# Altium schematic sheet 4Switch_DCDC.SchDoc
size OrCAD A; SheetNumber: 1; SheetTotal: 4
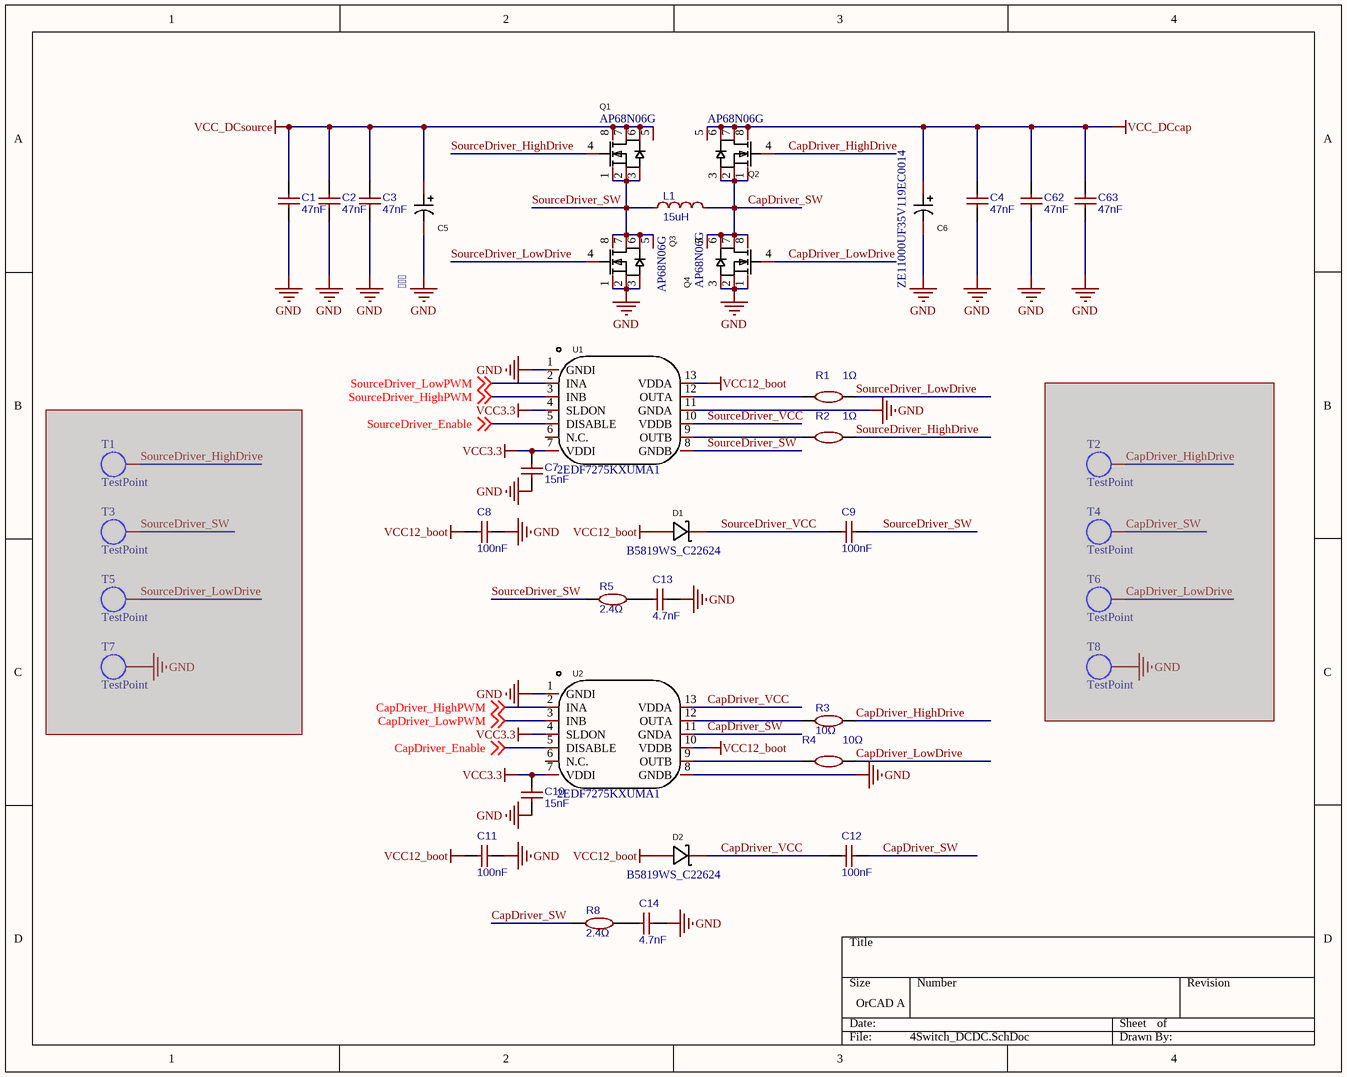
[diagram p0: 4Switch_DCDC.SchDoc]

## Parts
C1  47nF  [C-RAD-0805]
C2  47nF  [C-RAD-0805]
C3  47nF  [C-RAD-0805]
C4  47nF  [C-RAD-0805]
C5    [CAP-TH_BD10.0-P5.00-D0.6-FD-A]
C6  ZE11000UF35V119EC0014  [CAP-TH_BD10.0-P5.00-D0.6-FD-A]
C7  15nF  [C-RAD-0603]
C8  100nF  [C-RAD-0603]
C9  100nF  [C-RAD-0603]
C10  15nF  [C-RAD-0603]
C11  100nF  [C-RAD-0603]
C12  100nF  [C-RAD-0603]
C13  4.7nF  [C-RAD-0805]
C14  4.7nF  [C-RAD-0805]
C62  47nF  [C-RAD-0805]
C63  47nF  [C-RAD-0805]
D1  B5819WS_C22624  [SOD-323_L1.8-W1.3-LS2.5-BI]
D2  B5819WS_C22624  [SOD-323_L1.8-W1.3-LS2.5-BI]
L1  15uH  [L-SMD-22]
Q1  AP68N06G  [VDFN8]
Q2  AP68N06G  [VDFN8]
Q3  AP68N06G  [VDFN8]
Q4  AP68N06G  [VDFN8]
R1  1Ω  [0603-1]
R2  1Ω  [0603-1]
R3  10Ω  [0603-1]
R4  10Ω  [0603-1]
R5  2.4Ω  [0805-1]
R8  2.4Ω  [0805-1]
T1  TestPoint  [TestPoint]  (masked out: inside a compile mask, not in the netlist)
T2  TestPoint  [TestPoint]  (masked out: inside a compile mask, not in the netlist)
T3  TestPoint  [TestPoint]  (masked out: inside a compile mask, not in the netlist)
T4  TestPoint  [TestPoint]  (masked out: inside a compile mask, not in the netlist)
T5  TestPoint  [TestPoint]  (masked out: inside a compile mask, not in the netlist)
T6  TestPoint  [TestPoint]  (masked out: inside a compile mask, not in the netlist)
T7  TestPoint  [TestPoint]  (masked out: inside a compile mask, not in the netlist)
T8  TestPoint  [TestPoint]  (masked out: inside a compile mask, not in the netlist)
U1  2EDF7275KXUMA1  [LGA-13]
U2  2EDF7275KXUMA1  [LGA-13]

## Nets
GND: C1.1 C2.1 C3.1 C4.1 C5.2 C6.2 C7.1 C8.2 C10.1 C11.2 C13.2 C14.2 C62.1 C63.1 Q3.1(S) Q3.2(S) Q3.3(S) Q4.1(S) Q4.2(S) Q4.3(S) U1.1(GNDI) U1.11(GNDA) U2.1(GNDI) U2.8(GNDB)
VCC3.3: C7.2 C10.2 U1.4(SLDON) U1.7(VDDI) U2.4(SLDON) U2.7(VDDI)
VCC12_boot: C8.1 C11.1 D1.2(A) D2.2(A) U1.13(VDDA) U2.10(VDDB)
VCC_DCcap: C4.2 C6.1 C62.2 C63.2 Q2.5(D) Q2.6(D) Q2.7(D) Q2.8(D)
VCC_DCsource: C1.2 C2.2 C3.2 C5.1 Q1.5(D) Q1.6(D) Q1.7(D) Q1.8(D)
CapDriver_Enable: U2.5(DISABLE) ; off-sheet CapDriver_Enable
CapDriver_HighDrive: Q2.4(G) R3.2
CapDriver_HighPWM: U2.2(INA) ; off-sheet CapDriver_HighPWM
CapDriver_LowDrive: Q4.4(G) R4.2
CapDriver_LowPWM: U2.3(INB) ; off-sheet CapDriver_LowPWM
CapDriver_SW: C12.2 L1.2 Q2.1(S) Q2.2(S) Q2.3(S) Q4.5(D) Q4.6(D) Q4.7(D) Q4.8(D) R8.1 U2.11(GNDA)
CapDriver_VCC: C12.1 D2.1(K) U2.13(VDDA)
SourceDriver_Enable: U1.5(DISABLE) ; off-sheet SourceDriver_Enable
SourceDriver_HighDrive: Q1.4(G) R2.2
SourceDriver_HighPWM: U1.3(INB) ; off-sheet SourceDriver_HighPWM
SourceDriver_LowDrive: Q3.4(G) R1.2
SourceDriver_LowPWM: U1.2(INA) ; off-sheet SourceDriver_LowPWM
SourceDriver_SW: C9.2 L1.1 Q1.1(S) Q1.2(S) Q1.3(S) Q3.5(D) Q3.6(D) Q3.7(D) Q3.8(D) R5.1 U1.8(GNDB)
SourceDriver_VCC: C9.1 D1.1(K) U1.10(VDDB)
NetC13_1: C13.1 R5.2
NetC14_1: C14.1 R8.2
NetR1_1: R1.1 U1.12(OUTA)
NetR2_1: R2.1 U1.9(OUTB)
NetR3_1: R3.1 U2.12(OUTA)
NetR4_1: R4.1 U2.9(OUTB)

Not connected (* = marked no-connect by the designer): U1 6(N.C.); U2 6(N.C.)

## Library data of the parts
C1-C4 C62 C63 = 47nF: CL21B473KBCNNNC; BOM_Manufacturer: Guangdong Fenghua Advanced Tech; nameAlias: Capacitance; Contributor: LCSC; BOM_Supplier: LCSC; BOM_Supplier Part: C157687; BOM_Manufacturer Part: CL21B473KBCNNNC; BOM_JLCPCB Part Class: Extended Part; spicePre: C; spiceSymbolName: 0805CG330J500NT
C5 C6 = ZE11000UF35V119EC0014: Manufacturer: KNSCHA(科尼盛); Name: 1000uF; Add into BOM: yes; Value: 1000uF; Tolerance: ±20%; Rated Voltage: 35V; φD: 10mm; L: 17mm; Ripple Current: 6.2A@100kHz; Equivalent Series Resistance(ESR): 8mΩ@100kHz; Lifetime @ Temp: 2000hrs@105℃; Symbol: ZE11000UF35V119EC0014; Device: ZE11000UF35V119EC0014; LCSC Part Name: 1000uF ±20% 35V; Supplier Part: C2992586; Manufacturer Part: ZE11000UF35V119EC0014; Supplier Footprint: 径向引线,10x17mm; JLCPCB Part Class: Extended Part; Datasheet: https://atta.szlcsc.com/upload/public/pdf/source/20220418/57B24F92C08E224D784EAACECC03E503.pdf; Supplier: LCSC; Convert to PCB: yes; Lead Spacing: 5mm; Operating Temperature: -40℃~+105℃
C7 C10 = 15nF: BOM_Manufacturer: Guangdong Fenghua Advanced Tech; BOM_Manufacturer Part: 0805CG330J500NT; nameAlias: Capacitance; Contributor: LCSC; BOM_Supplier: LCSC; BOM_Supplier Part: C157687; BOM_JLCPCB Part Class: Extended Part; spicePre: C; spiceSymbolName: 0805CG330J500NT
C8 C9 C11 C12 = 100nF: BOM_Manufacturer: Guangdong Fenghua Advanced Tech; BOM_Manufacturer Part: 0805CG330J500NT; nameAlias: Capacitance; Contributor: LCSC; BOM_Supplier: LCSC; BOM_Supplier Part: C157687; BOM_JLCPCB Part Class: Extended Part; spicePre: C; spiceSymbolName: 0805CG330J500NT
C13 C14 = 4.7nF: BOM_Manufacturer: Guangdong Fenghua Advanced Tech; BOM_Manufacturer Part: 0805CG330J500NT; nameAlias: Capacitance; Contributor: LCSC; BOM_Supplier: LCSC; BOM_Supplier Part: C157687; BOM_JLCPCB Part Class: Extended Part; spicePre: C; spiceSymbolName: 0805CG330J500NT
D1 D2 = B5819WS_C22624: Manufacturer: CJ(江苏长电/长晶); Add into BOM: yes; Reverse Voltage (Vr): 40V; Average Rectified Current (Io): 1A; Forward Voltage (Vf@If): 600mV@1A; Name: B5819WS; Symbol: B5819WS_C22624; Device: B5819WS_C22624; LCSC Part Name: 40V 1A 600mV@1A; Supplier Part: C22624; Manufacturer Part: B5819WS; Supplier Footprint: SOD-323; JLCPCB Part Class: Extended Part; Datasheet: https://atta.szlcsc.com/upload/public/pdf/source/20170919/C22624_1505799673448977596.pdf; Supplier: LCSC; Convert to PCB: yes
L1 = 15uH_CY: BOM_Manufacturer: 3L COILS; BOM_Manufacturer Part: SNR8040K-470M; nameAlias: Inductance; Contributor: LCSC; BOM_Supplier: LCSC; BOM_Supplier Part: C326356; spicePre: L; spiceSymbolName: SNR8040K-470M
Q1-Q4 = AP68N06G: Manufacturer: AOS; Name: AO3400A; Device: AO3400A_C20917; Add into BOM: yes; Type: N沟道; Drain Source Voltage (Vdss): 30V; Continuous Drain Current (Id): 5.7A; Power Dissipation (Pd): 1.4W; Drain Source On Resistance (RDS(on)@Vgs,Id): 26.5mΩ@10V,5.7A; Gate Threshold Voltage (Vgs(th)@Id): 1.5V@250μA; Symbol: AO3400A; LCSC Part Name: N沟道 30V 5.7A; Supplier Part: C20917; Manufacturer Part: AO3400A; Supplier Footprint: SOT-23-3L; JLCPCB Part Class: Basic Part; Datasheet: https://atta.szlcsc.com/upload/public/pdf/source/20140107/1457706668533.pdf; Supplier: LCSC; Convert to PCB: yes
R1-R4 = 10Ω: BOM_Manufacturer: UniOhm; BOM_Manufacturer Part: 0603WAF1002T5E; nameAlias: Resistance; Resistance (Ohms): 10K; BOM_Supplier: LCSC; BOM_Supplier Part: C25804; BOM_JLCPCB Part Class: Basic Part; spicePre: R; spiceSymbolName: 0603WAF1002T5E
R5 R8 = 2.4Ω: BOM_Manufacturer: UniOhm; BOM_Manufacturer Part: 0603WAF1002T5E; nameAlias: Resistance; Resistance (Ohms): 10K; BOM_Supplier: LCSC; BOM_Supplier Part: C25804; BOM_JLCPCB Part Class: Basic Part; spicePre: R; spiceSymbolName: 0603WAF1002T5E
U1 U2 = 2EDF7275KXUMA1: Manufacturer: Infineon(英飞凌); Add into BOM: yes; Driven Configuration: 半桥; Number of Drivers: 2; loadtype: MOSFET; Supply Voltage: 3V~3.5V; Peak Output Current(sink): 4A; Peak Output Current(source): 8A; Rise Time: 6.5ns; Fall Time: 4.5ns; Name: 2EDF7275KXUMA1; Symbol: 2EDF7275KXUMA1; Device: 2EDF7275KXUMA1; LCSC Part Name: 半桥 MOSFET 灌:4A 拉:8A; Supplier Part: C2677063; Manufacturer Part: 2EDF7275KXUMA1; Supplier Footprint: TFLGA-13-1; JLCPCB Part Class: Extended Part; Datasheet: https://atta.szlcsc.com/upload/public/pdf/source/20210606/C69F41D9A598FEEE25D6E8D6BBA83E77.pdf; Supplier: LCSC; Convert to PCB: yes; Operating Temperature: -40℃~+150℃@(Tj)